# Altium project Hydrophone_preamplifier_V2.PrjPcb
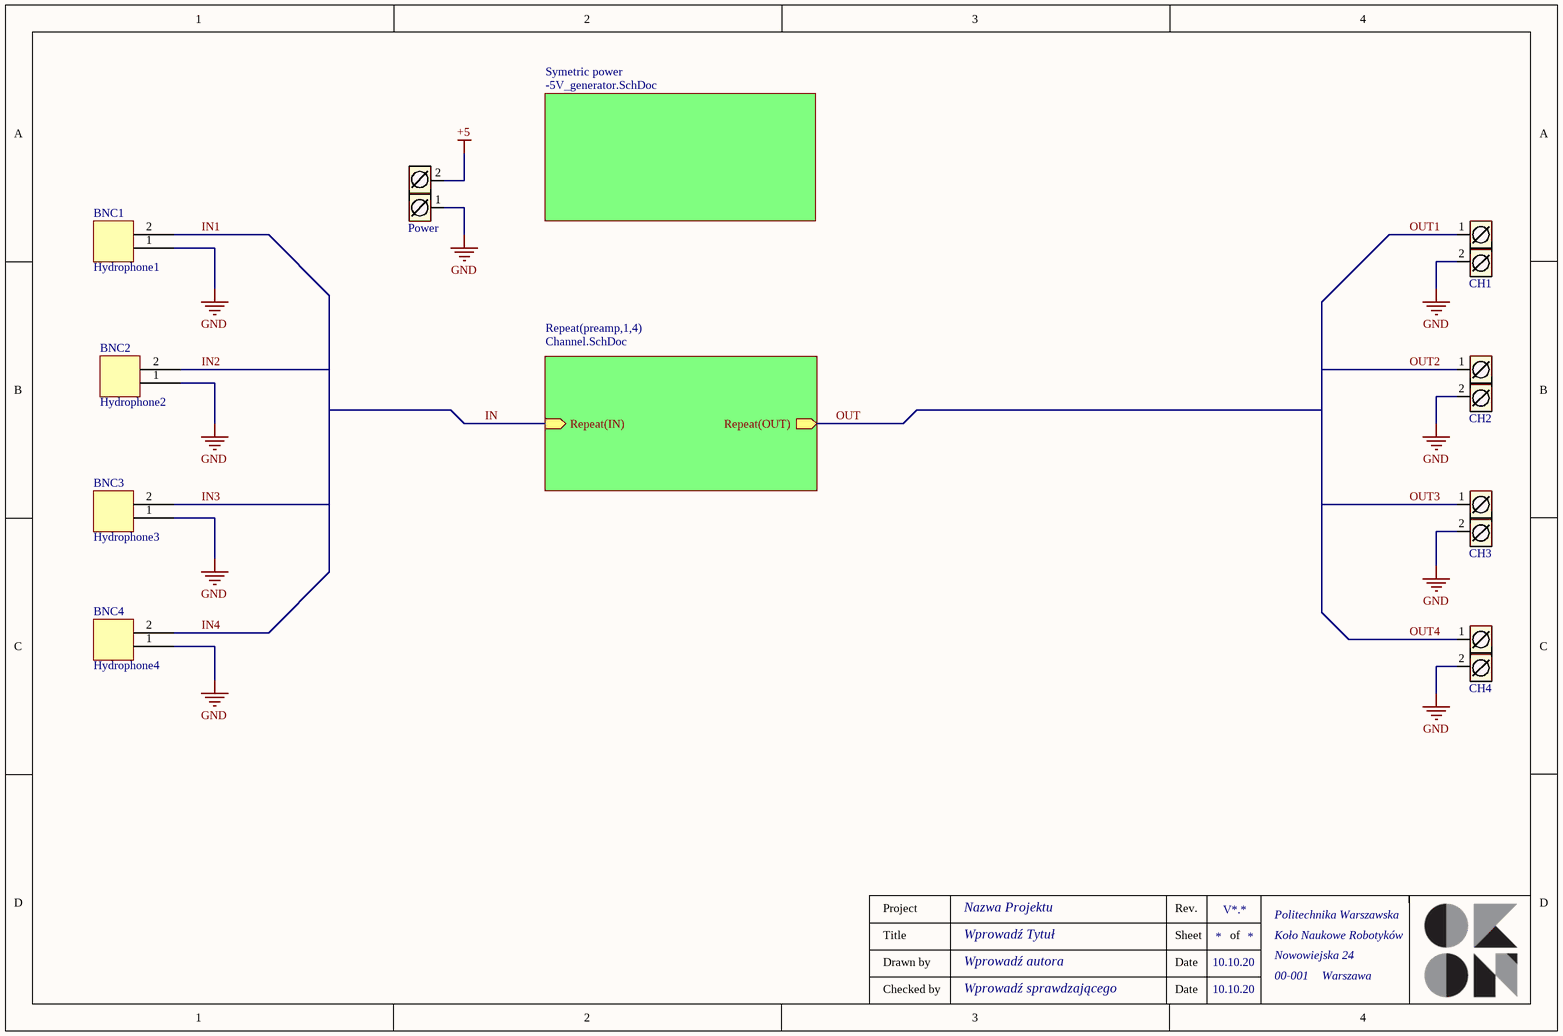
[diagram p0: Hydrophone_preamp_Main_schematic.SchDoc]
5 sheets, 118 parts. Net scope: hierarchical (ports join the sheet entries above them; power ports are global).
Board file: Hydrophone_preamplifier_V2.PcbDoc
Sheets:
  Hydrophone_preamp_Main_schematic.SchDoc
    preamp1 = Channel.SchDoc
      IG = Input_Gain.SchDoc
      LP = Low_Pass_48kHz.SchDoc
    preamp2 = Channel.SchDoc
      IG = Input_Gain.SchDoc
      LP = Low_Pass_48kHz.SchDoc
    preamp3 = Channel.SchDoc
      IG = Input_Gain.SchDoc
      LP = Low_Pass_48kHz.SchDoc
    preamp4 = Channel.SchDoc
      IG = Input_Gain.SchDoc
      LP = Low_Pass_48kHz.SchDoc
    Symetric power = -5V_generator.SchDoc

## Sheet Hydrophone_preamp_Main_schematic.SchDoc: Wprowadź Tytuł
size A4; CheckedBy: Wprowadź sprawdzającego; CompanyName: Politechnika Warszawska; DrawnBy: Wprowadź autora; Organization: Koło Naukowe Robotyków; Address1: Nowowiejska 24; Address2: 00-001; Address3: Warszawa; Address4: Polska; Revision: V*.*; DrawnDate: 10.10.20; CheckDate: 10.10.20; ProjectName: Nazwa Projektu

### Parts
BNC1  Hydrophone1  [BNC]
BNC2  Hydrophone2  [BNC]
BNC3  Hydrophone3  [BNC]
BNC4  Hydrophone4  [BNC]
CH1  ARK2  [ARK2]  (value not drawn)
CH2  ARK2  [ARK2]  (value not drawn)
CH3  ARK2  [ARK2]  (value not drawn)
CH4  ARK2  [ARK2]  (value not drawn)
Power  ARK2  [ARK2]  (value not drawn)

### Sub-sheets
Repeat(preamp,1,4) = Channel.SchDoc: Repeat(IN) (in), Repeat(OUT) (out)
Symetric power = -5V_generator.SchDoc: no entries

### Nets
+5: Power.2
GND: BNC1.1 BNC2.1 BNC3.1 BNC4.1 CH1.2 CH2.2 CH3.2 CH4.2 Power.1
IN: sheet Repeat(preamp,1,4)/Repeat(IN)
IN1: BNC1.2
IN2: BNC2.2
IN3: BNC3.2
IN4: BNC4.2
OUT: sheet Repeat(preamp,1,4)/Repeat(OUT)
OUT1: CH1.1
OUT2: CH2.1
OUT3: CH3.1
OUT4: CH4.1

### Notes on the sheet
- Project
- Rev.
- Title
- Drawn by
- Date
- Sheet
- of
- Checked by

### Library data of the parts
BNC1-BNC4 = BNC gniazdo: ComponentLink1Description: TME; ComponentLink1URL: https://www.tme.eu/pl/details/5-1634503-1/zlacza-bnc/te-connectivity/; ComponentLink2Description: datasheet; ComponentLink2URL: https://www.tme.eu/Document/98c590ab217976accc479c0d40976d37/5-1634503-1.pdf
CH1-CH4 Power = ARK2: Złącze śrubowe 2 piny

## Sheet Channel.SchDoc: Wprowadź Tytuł
size A4; CheckedBy: Wprowadź sprawdzającego; CompanyName: Politechnika Warszawska; DrawnBy: Wprowadź autora; Organization: Koło Naukowe Robotyków; Address1: Nowowiejska 24; Address2: 00-001; Address3: Warszawa; Address4: Polska; Revision: V*.*; DrawnDate: 10.10.20; CheckDate: 10.10.20; ProjectName: Nazwa Projektu
Used 4 times, as channels preamp1, preamp2, preamp3, preamp4. Parts and nets are listed once, with the designators drawn on the sheet.
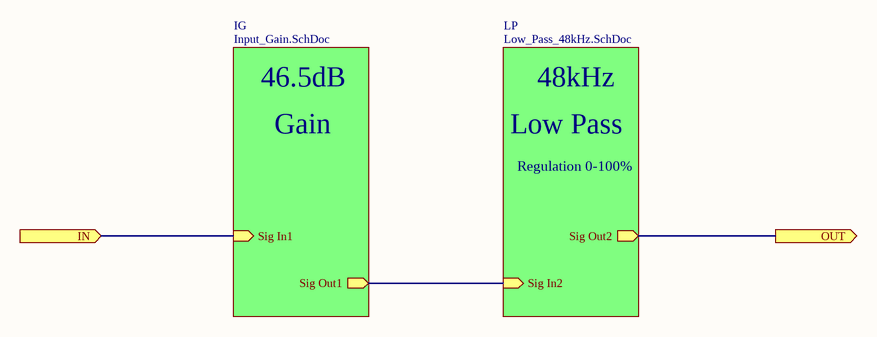
[diagram p1: Channel.SchDoc]

### Sub-sheets
IG = Input_Gain.SchDoc: Sig In1 (in), Sig Out1 (out)
LP = Low_Pass_48kHz.SchDoc: Sig In2 (in), Sig Out2 (out)

### Ports
IN (in), OUT (out)

### Nets
IN: port IN, sheet IG/Sig In1
OUT: port OUT, sheet LP/Sig Out2
(unnamed): sheet IG/Sig Out1, sheet LP/Sig In2

### Channels
preamp1: ports IN=IN1 OUT=OUT1
preamp2: ports IN=IN2 OUT=OUT2
preamp3: ports IN=IN3 OUT=OUT3
preamp4: ports IN=IN4 OUT=OUT4

### Notes on the sheet
- 46.5dB
- Gain
- Low Pass
- 48kHz
- Regulation 0-100%
- Project
- Rev.
- Title
- Drawn by
- Date
- Sheet
- of
- Checked by

## Sheet Input_Gain.SchDoc: Wprowadź Tytuł
size A4; CheckedBy: Wprowadź sprawdzającego; CompanyName: Politechnika Warszawska; DrawnBy: Wprowadź autora; Organization: Koło Naukowe Robotyków; Address1: Nowowiejska 24; Address2: 00-001; Address3: Warszawa; Address4: Polska; Revision: V*.*; DrawnDate: 10.10.20; CheckDate: 10.10.20; ProjectName: Nazwa Projektu
Used 4 times, as channels preamp1/IG, preamp2/IG, preamp3/IG, preamp4/IG. Parts and nets are listed once, with the designators drawn on the sheet.
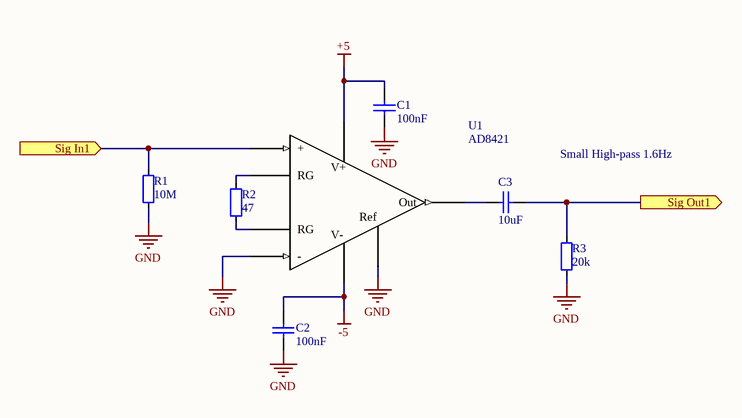
[diagram p2: Input_Gain.SchDoc]

### Parts
C1  value 100nF  [CAPC0603M]  (hidden comment: Cap)
C2  value 100nF  [CAPC0603M]  (hidden comment: Cap)
C3  value 10uF  [CAPC0603M]  (hidden comment: Cap)
R1  10M  [RESC0603]
R2  47  [RESC0603]
R3  20k  [RESC0603]
U1  AD8421  [SOIC127P600X175-8N]

### Ports
Sig In1 (in), Sig Out1 (out)

### Nets
+5: C1.2 U1.8(V+)
-5: C2.1 U1.5(V-)
GND: C1.1 C2.2 R1.1 R3.1 U1.1(-) U1.6(Ref)
Sig In1: R1.2 U1.4(+) ; port Sig In1
Sig Out1: C3.2 R3.2 ; port Sig Out1
NetC3_1: C3.1 U1.7(Out)
NetR2_1: R2.1 U1.3(RG)
NetR2_2: R2.2 U1.2(RG)

### Channels
preamp1/IG: designators end in _IG1; ports Sig In1=IN1 Sig Out1=NetC3_IG1_2
preamp2/IG: designators end in _IG2; ports Sig In1=IN2 Sig Out1=NetC3_IG2_2
preamp3/IG: designators end in _IG3; ports Sig In1=IN3 Sig Out1=NetC3_IG3_2
preamp4/IG: designators end in _IG4; ports Sig In1=IN4 Sig Out1=NetC3_IG4_2

### Notes on the sheet
- Small High-pass 1.6Hz
- Project
- Rev.
- Title
- Drawn by
- Date
- Sheet
- of
- Checked by

### Library data of the parts
C1-C3 = Cap: Ceramic capacitor; Unit Price1: *; Unit Price2: *
R1-R3 = RES: Resistior
  R1: Value: 10M
  R2: Value: 47
  R3: Value: 20k
U1 = AD8421: 10MHz    +-2.5-18V  Instrumentation Amplifier; ComponentLink1Description: datasheet; ComponentLink1URL: https://www.tme.eu/Document/c72dc595607ee32045c3f9fad3f223f3/AD8421.pdf; ComponentLink2Description: TME; ComponentLink2URL: https://www.tme.eu/pl/details/ad8421arz/wzmacniacze-operacyjne-smd/analog-devices/

## Sheet Low_Pass_48kHz.SchDoc: Wprowadź Tytuł
size A4; CheckedBy: Wprowadź sprawdzającego; CompanyName: Politechnika Warszawska; DrawnBy: Wprowadź autora; Organization: Koło Naukowe Robotyków; Address1: Nowowiejska 24; Address2: 00-001; Address3: Warszawa; Address4: Polska; Revision: V*.*; DrawnDate: 10.10.20; CheckDate: 10.10.20; ProjectName: Nazwa Projektu
Used 4 times, as channels preamp1/LP, preamp2/LP, preamp3/LP, preamp4/LP. Parts and nets are listed once, with the designators drawn on the sheet.
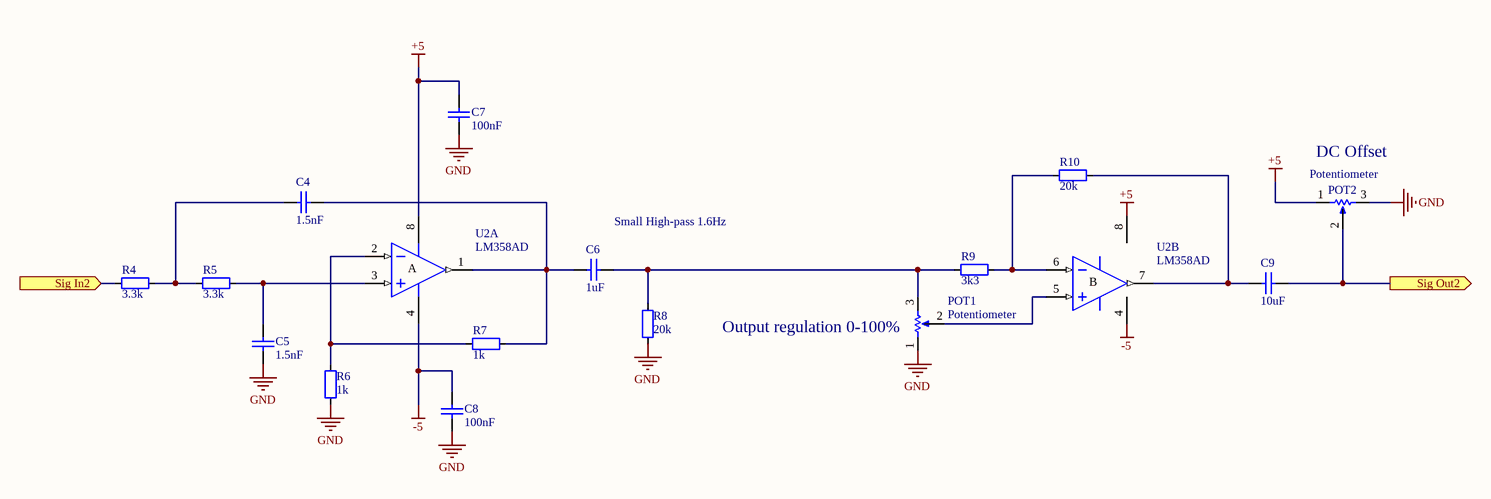
[diagram p3: Low_Pass_48kHz.SchDoc]

### Parts
C4  value 1.5nF  [CAPC0603M]  (hidden comment: Cap)
C5  value 1.5nF  [CAPC0603M]  (hidden comment: Cap)
C6  value 1uF  [CAPC0603M]  (hidden comment: Cap)
C7  value 100nF  [CAPC0603M]  (hidden comment: Cap)
C8  value 100nF  [CAPC0603M]  (hidden comment: Cap)
C9  value 10uF  [CAPC0603M]  (hidden comment: Cap)
POT1  Potentiometer  [Pot_3296]
POT2  Potentiometer  [Pot_3296]
R4  3.3k  [RESC0603]
R5  3.3k  [RESC0603]
R6  1k  [RESC0603]
R7  1k  [RESC0603]
R8  20k  [RESC0603]
R9  3k3  [RESC0603]
R10  20k  [RESC0603]
U2  LM358AD  [SO-8_N]  (parts A,B of 2)

### Ports
Sig In2 (in), Sig Out2 (out)

### Nets
+5: C7.1 POT2.1 U2.8(V+)
-5: C8.1 U2.4(V-)
GND: C5.1 C7.2 C8.2 POT1.1 POT2.3 R6.1 R8.1
Sig In2: R4.1 ; port Sig In2
Sig Out2: C9.1 POT2.2 ; port Sig Out2
NetC4_1: C4.1 C6.2 R7.2 U2.1(OUT)
NetC4_2: C4.2 R4.2 R5.1
NetC5_2: C5.2 R5.2 U2.3(IN+)
NetC6_1: C6.1 POT1.3 R8.2 R9.2
NetC9_2: C9.2 R10.1 U2.7(OUT)
NetPOT1_2: POT1.2 U2.5(IN+)
NetR6_2: R6.2 R7.1 U2.2(IN-)
NetR9_1: R9.1 R10.2 U2.6(IN-)

### Channels
preamp1/LP: designators end in _LP1; ports Sig In2=NetC3_IG1_2 Sig Out2=OUT1
preamp2/LP: designators end in _LP2; ports Sig In2=NetC3_IG2_2 Sig Out2=OUT2
preamp3/LP: designators end in _LP3; ports Sig In2=NetC3_IG3_2 Sig Out2=OUT3
preamp4/LP: designators end in _LP4; ports Sig In2=NetC3_IG4_2 Sig Out2=OUT4

### Notes on the sheet
- (near POT2) DC Offset
- (near C6) Small High-pass 1.6Hz
- (near POT1) Output regulation 0-100%
- Project
- Rev.
- Title
- Drawn by
- Date
- Sheet
- of
- Checked by
- (in symbol LM358AD, part A) A
- (in symbol LM358AD, part B) B

### Library data of the parts
C4-C9 = Cap: Ceramic capacitor; Unit Price1: *; Unit Price2: *
R4-R10 = RES: Resistior
  R4 R5: Value: 3.3k
  R6 R7: Value: 1k
  R8 R10: Value: 20k
  R9: Value: 3k3
U2 = LM358AD: Low-Power Dual Operational Amplifier; Published: 24-Aug-2001; LatestRevisionDate: 13-Apr-2006; LatestRevisionNote: IPC-7351 Footprint Added.; DatasheetVersion: Jun-1998; PackageVersion: Dec-2002; PackageReference: SO8; Publisher: Altium Limited; PackageDescription: 8-Pin Small Outline Integrated Circuit 1.27 mm Pitch; Code_JEDEC: MS-012-AA; Code_IPC: SOIC127P600-8; ComponentLink1Description: Manufacturer Link; ComponentLink1URL: http://www.st.com/; ComponentLink2Description: Datasheet; ComponentLink2URL: http://www.st.com/stonline/products/literature/ds/2163/lm358.pdf

## Sheet -5V_generator.SchDoc: Wprowadź Tytuł
size A4; CheckedBy: Wprowadź sprawdzającego; CompanyName: Politechnika Warszawska; DrawnBy: Wprowadź autora; Organization: Koło Naukowe Robotyków; Address1: Nowowiejska 24; Address2: 00-001; Address3: Warszawa; Address4: Polska; Revision: V*.*; DrawnDate: 10.10.20; CheckDate: 10.10.20; ProjectName: Nazwa Projektu
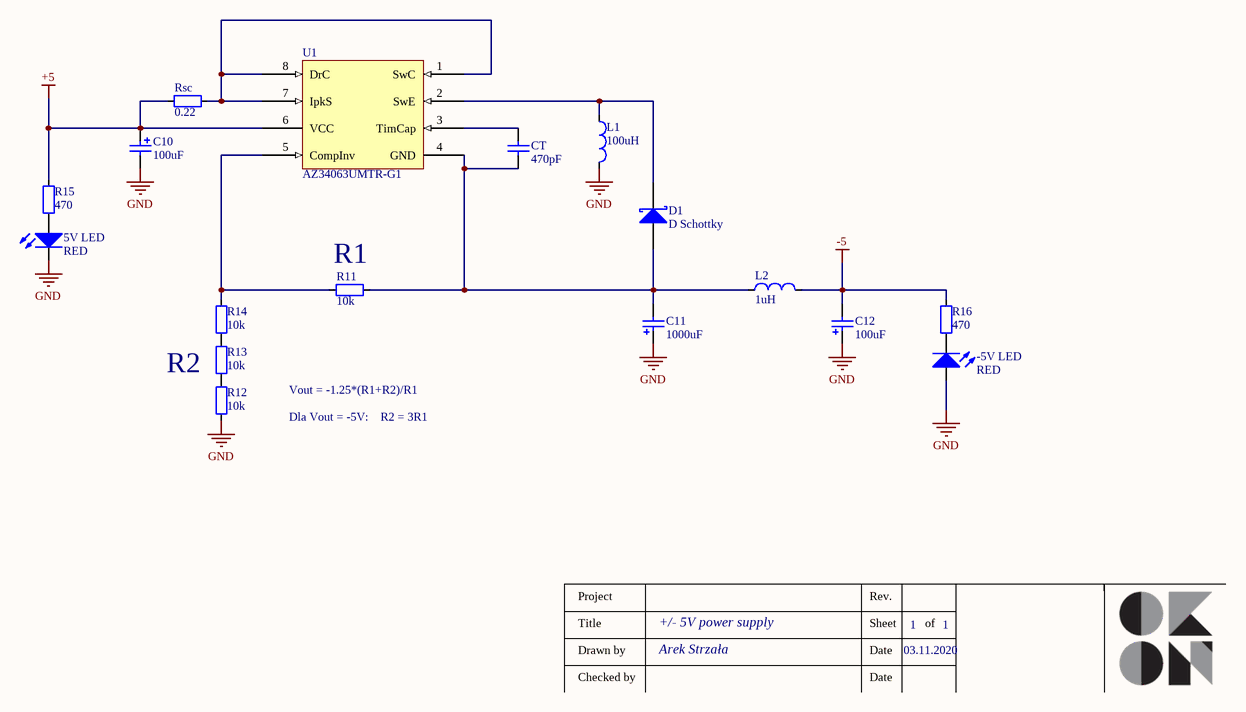
[diagram p4: -5V_generator.SchDoc]

### Parts
5V_LED  RED  [0805_led_yellow]
-5V_LED  RED  [0805_led_yellow]
C10  100uF  [Con_SMD_5x5.5]
C11  1000uF  [Con_SMD_5x5.5]
C12  100uF  [Con_SMD_5x5.5]
CT  value 470pF  [CAPC0603M]  (hidden comment: Cap)
D1  D Schottky  [SOD323F]
L1  100uH  [0805_IND]
L2  1uH  [0805_IND]
R11  10k  [RESC0603]
R12  10k  [RESC0603]
R13  10k  [RESC0603]
R14  10k  [RESC0603]
R15  470  [RESC0603]
R16  470  [RESC0603]
Rsc  0.22  [RESC0603]
U1  AZ34063UMTR-G1  [SOIC127P600X175-8N]

### Nets
+5: C10.1 R15.2 Rsc.1 U1.6(VCC)
-5: C12.2 L2.2 R16.2
GND: 5V_LED.2(K) -5V_LED.1(A) C10.2 C11.1 C12.1 L1.2 R12.1
Net5V_LED_1: 5V_LED.1(A) R15.1
Net-5V_LED_2: -5V_LED.2(K) R16.1
NetC11_2: C11.2 CT.2 D1.1(A) L2.1 R11.2 U1.4(GND)
NetCT_1: CT.1 U1.3(TimCap)
NetD1_2: D1.2(K) L1.1 U1.2(SwE)
NetR11_1: R11.1 R14.2 U1.5(CompInv)
NetR12_2: R12.2 R13.1
NetR13_2: R13.2 R14.1
NetRsc_2: Rsc.2 U1.1(SwC) U1.7(IpkS) U1.8(DrC)

### Notes on the sheet
- (near R11) R1
- R2
- Vout = -1.25*(R1+R2)/R1
- Dla Vout = -5V:    R2 = 3R1
- Project
- Rev.
- Title
- Drawn by
- Arek Strzała
- +/- 5V power supply
- Date
- Sheet
- 03.11.2020
- 1
- of
- Checked by

### Library data of the parts
5V_LED -5V_LED = LED: Light-emitting diode; COLOR: RED
C10-C12 = Cap_Pol: Polar capacitor
  C10 C12: Value: 100uF
  C11: Value: 1000uF
CT = Cap: Ceramic capacitor; Unit Price1: *; Unit Price2: *
D1 = D Schottky: Schottky Diode; Published: 8-Jun-2000; LatestRevisionDate: 17-Jul-2002; LatestRevisionNote: Re-released for DXP Platform.; PackageReference: SMB; Publisher: Altium Limited; PackageDescription: DO-214-AA/SMB; 2 C-Bend Leads; Body 5.3 x 3.6 mm, inc. leads (LxW); Code_JEDEC: DO-214-AA
L1 L2 = Inductor: Code_IEC: 1005; Value: 10uH; Published: 8-Jun-2000; LatestRevisionDate: 29-May-2009; LatestRevisionNote: IPC-7351 Footprint Added.; PackageReference: 0402-A; Publisher: Altium Limited; PackageDescription: Chip Inductor; Code_JEITA: 0402
R11-R16 Rsc = RES: Resistior
  R11-R14: Value: 10k
  R15 R16: Value: 470
  Rsc: Value: 0.22
U1 = AZ34063UMTR-G1: ComponentLink1Description: datasheet; ComponentLink1URL: https://www.tme.eu/Document/f583ca1a85dfa98789e5757031039545/AZ34063U.pdf; ComponentLink2Description: TME; ComponentLink2URL: https://www.tme.eu/pl/details/az34063umtr-g1/regulatory-napiecia-uklady-dc-dc/diodes-incorporated/

## Nets that join several sheets
+5: Hydrophone_preamp_Main_schematic (Power.2), preamp1/IG (C1_IG1.2 U1_IG1.8), preamp1/LP (C7_LP1.1 POT2_LP1.1 U2_LP1.8), preamp2/IG (C1_IG2.2 U1_IG2.8), preamp2/LP (C7_LP2.1 POT2_LP2.1 U2_LP2.8), preamp3/IG (C1_IG3.2 U1_IG3.8), preamp3/LP (C7_LP3.1 POT2_LP3.1 U2_LP3.8), preamp4/IG (C1_IG4.2 U1_IG4.8), preamp4/LP (C7_LP4.1 POT2_LP4.1 U2_LP4.8), -5V_generator (C10.1 R15.2 Rsc.1 U1.6)
-5: preamp1/IG (C2_IG1.1 U1_IG1.5), preamp1/LP (C8_LP1.1 U2_LP1.4), preamp2/IG (C2_IG2.1 U1_IG2.5), preamp2/LP (C8_LP2.1 U2_LP2.4), preamp3/IG (C2_IG3.1 U1_IG3.5), preamp3/LP (C8_LP3.1 U2_LP3.4), preamp4/IG (C2_IG4.1 U1_IG4.5), preamp4/LP (C8_LP4.1 U2_LP4.4), -5V_generator (C12.2 L2.2 R16.2)
GND: Hydrophone_preamp_Main_schematic (9 pins), preamp1/IG (6 pins), preamp1/LP (7 pins), preamp2/IG (6 pins), preamp2/LP (7 pins), preamp3/IG (6 pins), preamp3/LP (7 pins), preamp4/IG (6 pins), preamp4/LP (7 pins), -5V_generator (7 pins)
IN1: Hydrophone_preamp_Main_schematic (BNC1.2), preamp1/IG (R1_IG1.2 U1_IG1.4)
IN2: Hydrophone_preamp_Main_schematic (BNC2.2), preamp2/IG (R1_IG2.2 U1_IG2.4)
IN3: Hydrophone_preamp_Main_schematic (BNC3.2), preamp3/IG (R1_IG3.2 U1_IG3.4)
IN4: Hydrophone_preamp_Main_schematic (BNC4.2), preamp4/IG (R1_IG4.2 U1_IG4.4)
NetC3_IG1_2: preamp1/IG (C3_IG1.2 R3_IG1.2), preamp1/LP (R4_LP1.1)
NetC3_IG2_2: preamp2/IG (C3_IG2.2 R3_IG2.2), preamp2/LP (R4_LP2.1)
NetC3_IG3_2: preamp3/IG (C3_IG3.2 R3_IG3.2), preamp3/LP (R4_LP3.1)
NetC3_IG4_2: preamp4/IG (C3_IG4.2 R3_IG4.2), preamp4/LP (R4_LP4.1)
OUT1: Hydrophone_preamp_Main_schematic (CH1.1), preamp1/LP (C9_LP1.1 POT2_LP1.2)
OUT2: Hydrophone_preamp_Main_schematic (CH2.1), preamp2/LP (C9_LP2.1 POT2_LP2.2)
OUT3: Hydrophone_preamp_Main_schematic (CH3.1), preamp3/LP (C9_LP3.1 POT2_LP3.2)
OUT4: Hydrophone_preamp_Main_schematic (CH4.1), preamp4/LP (C9_LP4.1 POT2_LP4.2)